# Altium schematic sheet CON_LCD_TX09D50VM1CAA.SchDoc: TFT LCD Header
size A4; Organization: Altium Limited.; Address1: Level 3, 12a Rodborough Rd; Address2: Frenchs Forest 2086; Address3: NSW; Address4: AUSTRALIA; SheetNumber: 1; SheetTotal: 100
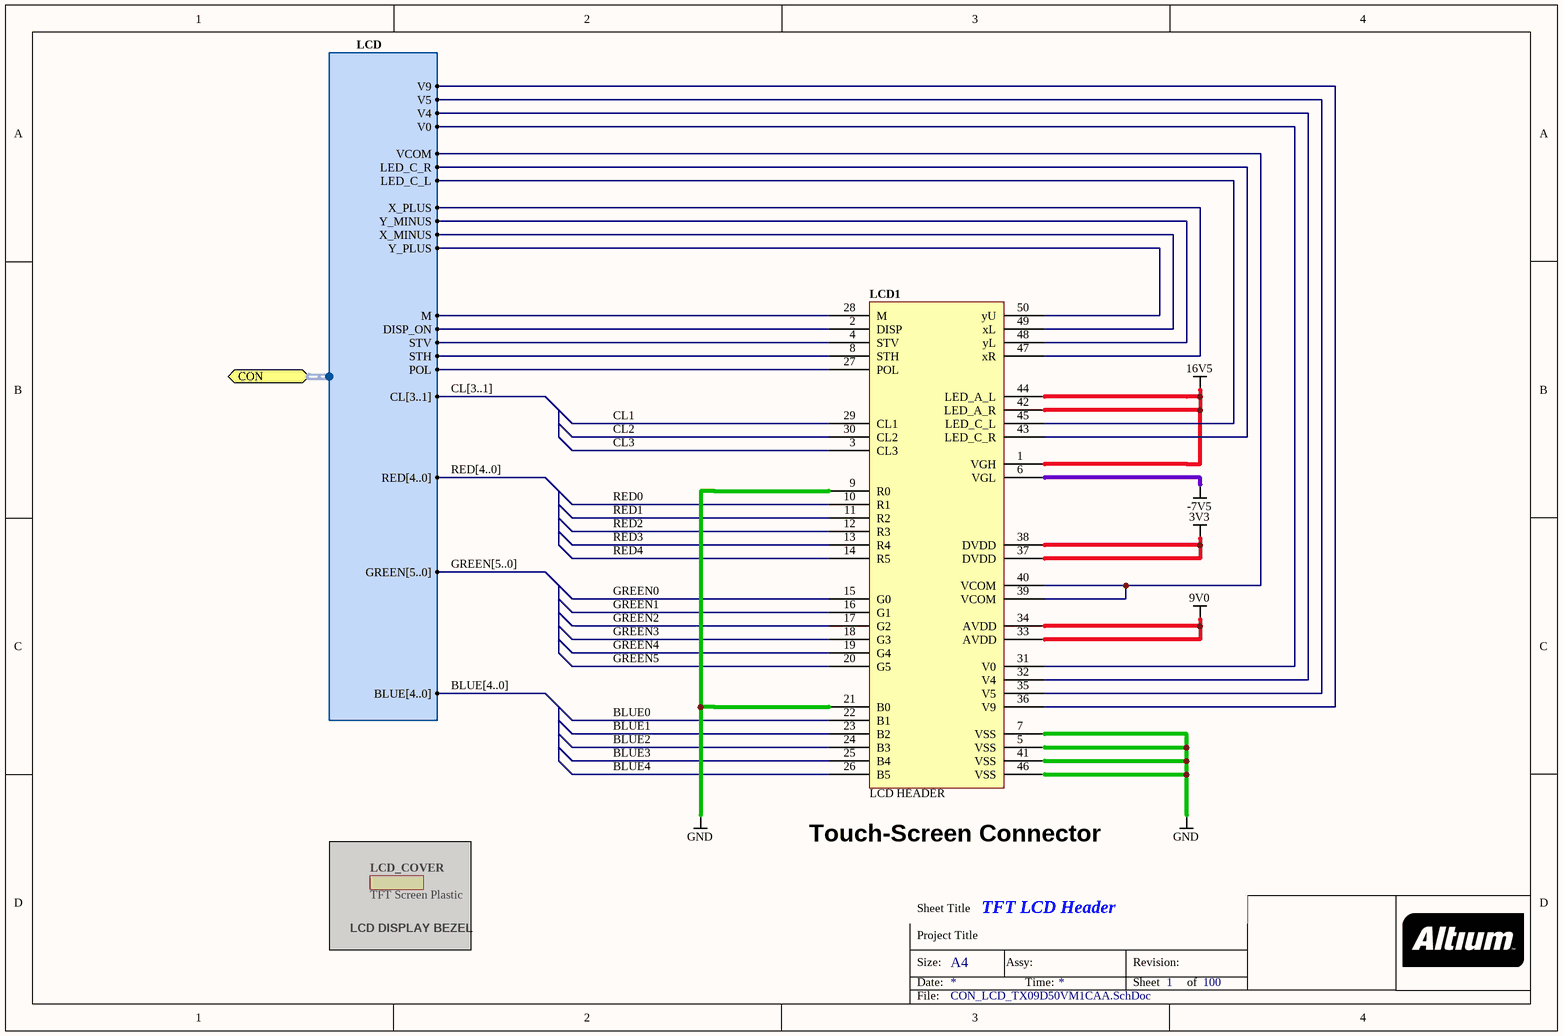
[diagram p0: CON_LCD_TX09D50VM1CAA.SchDoc]

## Parts
LCD1  LCD HEADER  [Hitachi_TX09D50VM1CAA]
LCD_COVER  TFT Screen Plastic  [NB2 ALTIUM LOGO]  (masked out: inside a compile mask, not in the netlist)

## Ports
CON (harness LCD)

## Harnesses
LCD: CL[3..1], RED[4..0], BLUE[4..0], M, DISP_ON, STV, STH, POL, Y_PLUS, X_MINUS, Y_MINUS, X_PLUS, GREEN[5..0], LED_C_L, LED_C_R, VCOM, V0, V4, V5, V9

## Nets
3V3: LCD1.37(DVDD) LCD1.38(DVDD)
9V0: LCD1.33(AVDD) LCD1.34(AVDD)
16V5: LCD1.1(VGH) LCD1.42(LED_A_R) LCD1.44(LED_A_L)
-7V5: LCD1.6(VGL)
GND: LCD1.5(VSS) LCD1.7(VSS) LCD1.9(R0) LCD1.21(B0) LCD1.41(VSS) LCD1.46(VSS)
BLUE0: LCD1.22(B1)
BLUE1: LCD1.23(B2)
BLUE2: LCD1.24(B3)
BLUE3: LCD1.25(B4)
BLUE4: LCD1.26(B5)
CL1: LCD1.29(CL1)
CL2: LCD1.30(CL2)
CL3: LCD1.3(CL3)
GREEN0: LCD1.15(G0)
GREEN1: LCD1.16(G1)
GREEN2: LCD1.17(G2)
GREEN3: LCD1.18(G3)
GREEN4: LCD1.19(G4)
GREEN5: LCD1.20(G5)
RED0: LCD1.10(R1)
RED1: LCD1.11(R2)
RED2: LCD1.12(R3)
RED3: LCD1.13(R4)
RED4: LCD1.14(R5)
NetLCD1_2: LCD1.2(DISP) ; port CON.DISP_ON
NetLCD1_4: LCD1.4(STV) ; port CON.STV
NetLCD1_8: LCD1.8(STH) ; port CON.STH
NetLCD1_27: LCD1.27(POL) ; port CON.POL
NetLCD1_28: LCD1.28(M) ; port CON.M
NetLCD1_31: LCD1.31(V0) ; port CON.V0
NetLCD1_32: LCD1.32(V4) ; port CON.V4
NetLCD1_35: LCD1.35(V5) ; port CON.V5
NetLCD1_36: LCD1.36(V9) ; port CON.V9
NetLCD1_39: LCD1.39(VCOM) LCD1.40(VCOM) ; port CON.VCOM
NetLCD1_43: LCD1.43(LED_C_R) ; port CON.LED_C_R
NetLCD1_45: LCD1.45(LED_C_L) ; port CON.LED_C_L
NetLCD1_47: LCD1.47(xR) ; port CON.X_PLUS
NetLCD1_48: LCD1.48(yL) ; port CON.Y_MINUS
NetLCD1_49: LCD1.49(xL) ; port CON.X_MINUS
NetLCD1_50: LCD1.50(yU) ; port CON.Y_PLUS

## Buses and harness runs
bus BLUE[4..0]
bus CL[3..1]
bus GREEN[5..0]
bus RED[4..0]

## Notes on the sheet
- (near LCD1) Touch-Screen Connector
- (near LCD_COVER) LCD DISPLAY BEZEL
- Sheet Title
- Project Title
- Size:
- Date:
- A4
- Assy:
- Time:
- Revision:
- Sheet
- of
- File:

## Library data of the parts
LCD1 = D-300-0010: Connector, 1 x 50 Pin, 0.5mm Pitch for Hitachi TX09D50VM1CAA TFT; Category: Connector; Connector type: LCD HEADER; Status: Production
LCD_COVER = Generic No Pins